# Altium schematic sheet H01R0_Frontend 1.SchDoc
size Letter; CompanyName: Hexabitz; DocumentNumber: 2; SheetNumber: 2; SheetTotal: 3
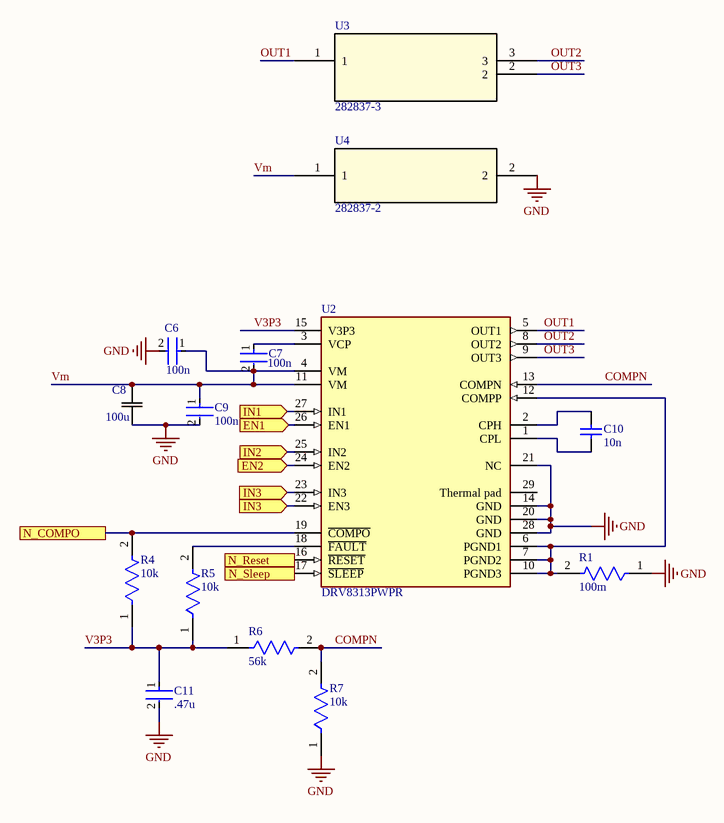
[diagram p0: H01R0_Frontend 1.SchDoc]

## Parts
C6  100n  [FP-1812-L_4_5_0_3-W_3_2_0-IPC_C]
C7  100n  [FP-1812-L_4_5_0_3-W_3_2_0-IPC_C]
C8  100u  [CAP_CL31A_SAM]
C9  100n  [FP-1812-L_4_5_0_3-W_3_2_0-IPC_C]
C10  10n  [CAPC1608X92X38NL15T08]
C11  .47u  [FP-C1206C-EB-MFG]
R1  100m  [FP-PCS2512-IPC_C]
R4  10k  [FP-CRCW2010-e3-IPC_B]
R5  10k  [FP-CRCW2010-e3-IPC_B]
R6  56k  [FP-SMA-A0207-MFG]
R7  10k  [FP-CRCW2010-e3-IPC_B]
U2  DRV8313PWPR  [FP-PWP0028C-IPC_B]
U3  282837-3  [282837-3_TYC]
U4  282837-2  [282837-2_TYC]

## Ports
EN1 (in), EN2 (in), IN1 (in), IN2 (in), IN3 (in), N_COMPO, N_Reset, N_Sleep

## Nets
GND: C6.2 C8.1 C9.2 C11.2 R1.1 R7.1 U2.14(GND) U2.20(GND) U2.21(NC) U2.28(GND) U4.2
COMPN: R6.2 R7.2 U2.13(COMPN)
EN1: U2.26(EN1) ; port EN1
EN2: U2.24(EN2) ; port EN2
IN1: U2.27(IN1) ; port IN1
IN2: U2.25(IN2) ; port IN2
IN3: U2.22(EN3) U2.23(IN3) ; port IN3
N_COMPO: R4.2 U2.19(~{COMPO}) ; port N_COMPO
N_Reset: U2.16(~{RESET}) ; port N_Reset
N_Sleep: U2.17(~{SLEEP}) ; port N_Sleep
OUT1: U2.5(OUT1) U3.1
OUT2: U2.8(OUT2) U3.3
OUT3: U2.9(OUT3) U3.2
V3P3: C11.1 R4.1 R5.1 R6.1 U2.15(V3P3)
Vm: C6.1 C7.2 C8.2 C9.1 U2.4(VM) U2.11(VM) U4.1
NetC7_1: C7.1 U2.3(VCP)
NetC10_1: C10.1 U2.1(CPL)
NetC10_2: C10.2 U2.2(CPH)
NetR1_2: R1.2 U2.6(PGND1) U2.7(PGND2) U2.10(PGND3) U2.12(COMPP)
NetR5_2: R5.2 U2.18(~{FAULT})

Not connected (* = marked no-connect by the designer): U2 29(Thermal_pad)

## Notes on the sheet
- Module:
- Title:
- Description:
- Size:
- Revision:
- Letter
- www.hexabitz.com
- Date:
- Time:
- Sheet
- of

## Library data of the parts
C6 C7 C9 = CMP-1040-01301-2: General Purpose Ceramic Capacitor, 1812, 100nF, 10%, X7R, 15%, 100V; Dissipation Factor: 2.5%; Max Operating Temperature: 125°C; Contact Plating: Tin; Mount: Surface Mount; Case Code (Metric): 4532; Voltage Rating (DC): 100V; Series: -; Case/Package: 1812; Width: 0.126inch; Tolerance: 10%; RoHS Compliant: Yes; Case Code (Imperial): 1812; Voltage: 100V; Dielectric: X7R; Radiation Hardening: No; Construction: Flat; REACH SVHC: No SVHC; Voltage Rating: 100V; Min Operating Temperature: -55°C; Thickness: 0.04inch; Length: 4.5mm; Height: 1.02mm; Packaging: Tape and Reel; Depth: 3.2mm; Package Quantity: 1; Lead Free: Lead Free; Capacitance: 100nF; Number of Pins: 2; Termination: SMD/SMT
C8 = CMP-001-00083-1: No Description Available; Manufacturer_Name: Samsung; Design Item ID: CL31A107MQHNNWE; Source: CL31A107MQHNNWE.SchLib; Manufacturer_Part_Number: CL31A107MQHNNWE; Copyright: Copyright (C) 2025 Ultra Librarian. All rights reserved.
C10 = CMP-2006-01186-1: Part Number: VJ0603Y103KXBAC; Manufacturer: Vitramon
C11 = CMP-03020-031970-1: C1206 0.47 μF X7R 10.00% 25 V; Manufacturer: KEMET; Manufacturer Part Number: C1206C474K3RAC7210; Automotive Grade: Grade 0; Material: Ceramic; Capacitance: 0.47 μF; Value: 0.47 μF; Voltage Rating: 25 V; Tolerance: 0.1; Temperature Coefficient: 15%; Package: C1206C-EB; Device Class L1: Passive Components; Automotive: Yes; Temperature Characteristic: X7R; ComponentLink2Description: Datasheet; Device Class L2: Capacitors; Height: 0.88mm; Category: Cap; Temperature Range High: +150°C; Lead Free: Yes; Temperature Range Low: -55°C; Octopart: https://octopart.com/c1206c474k3rac7210-kemet-13188669; Temperature: -55°C to +150°C; Device Class L3: Ceramic Capacitors; RoHS: TRUE; Mouser Description: Multilayer Ceramic Capacitors MLCC - SMD/SMT 0.47uF 25V 10%; Ipc Land Pattern Name: CAPC320160X78; ComponentLink2URL: https://content.kemet.com/datasheets/KEM_C1007_X8R_ULTRA_150C_SMD.pdf
R1 = CMP-33361-000026-1: 2W 0.100 OHMS 0.5% 2512; RoHS Compliant: Yes
R4 R5 R7 = CMP-1017-00623-2: RES Thick Film, 10kΩ, 1%, 0.75W, 100ppm/°C, 2010; Voltage Rating: 400V; Resistance: 10kR; Power Rating: 750mW; Width: 2.5mm; Case Code (Metric): 5025; Termination: SMD/SMT; Depth: 2.5mm; Contact Plating: Tin; Package Quantity: 4000; Temperature Coefficient: 100ppm/°C; Composition: Thick Film; Case/Package: 2010; Max Operating Temperature: 155°C; Military Standard: Not; Length: 5mm; Weight: 0.000899oz; Height: 0.6mm; Min Operating Temperature: -55°C; Tolerance: 1%; Lead Free: Lead Free; Packaging: Tape and Reel; Case Code (Imperial): 2010; Radiation Hardening: No; Voltage Rating (DC): 400V
R6 = CMP-03211-007753-1: SMA-A 0207 56KΩ 1W 15ppm/ºC 0.10% 350V; Manufacturer: TE Connectivity; Manufacturer Part Number: SMA-A0207BTNT56K; Tolerance: 0.001; Automotive Grade: Grade 0; Series: SMA-A; ComponentLink2URL: https://www.te.com/commerce/DocumentDelivery/DDEController?Action=showdoc&DocId=Data+Sheet%7F6-1773446-2%7F1%7Fpdf%7FEnglish%7FENG_DS_6-1773446-2_1.pdf%7F3-2176316-27088; Temperature Range Low: -55°C; Temperature Coefficient: 15ppm/ºC; Device Class L3: Chip SMD Resistors; RoHS: TRUE; Temperature: -55°C to +155°C; Footprint Url: https://www.te.com/commerce/DocumentDelivery/DDEController?Action=showdoc&DocId=Customer+Drawing%7F2176316%7FBA%7Fpdf%7FEnglish%7FENG_CD_2176316_BA.pdf%7F3-2176316-27088; Power Rating: 1W; Octopart: https://octopart.com/sma-a0207btnt56k-te+connectivity-89230475; Temperature Range High: +155°C; Value: 56KΩ; Device Class L1: Passive Components; Automotive: Yes; Resistance: 56KΩ; Composition: Metal Film; Device Class L2: Resistors; Category: Res; Lead Free: Yes; Height: 2.4mm; ComponentLink2Description: Datasheet; Voltage Rating: 350V; Package: SMA-A0207
U2 = CMP-04915-000025-1: IC MOTOR DRIVER 8V-60V 28HTSSOP; Min Supply Voltage: 8V; Max Supply Voltage: 60V; Interface: Parallel; Output Current: 1.75A; Number of Outputs: 1; Logic Function: AND GATE; Package Quantity: 2000; Number of Pins: 28; Case/Package: HTSSOP; Min Operating Temperature: -40°C; Mount: Surface Mount; Series: -; Packaging: Tape and Reel; Max Operating Temperature: 125°C; Lead Free: Lead Free
U3 = CMP-007-000000-1: TERMI-BLOK PCB MOUNT 3P; Manufacturer_Name: TE Connectivity; Source: 282837-3.SchLib; Type: Type; Copyright: Copyright (C) 2025 Ultra Librarian. All rights reserved.; Design Item ID: 282837-3; RefDes: RefDes; Manufacturer_Part_Number: 282837-3
U4 = CMP-010-000000-1: TERMI-BLOK PCB MOUNT 2P; Manufacturer_Name: TE Connectivity; Source: 282837-2.SchLib; RefDes: RefDes; Type: Type; Copyright: Copyright (C) 2025 Ultra Librarian. All rights reserved.; Design Item ID: 282837-2; Manufacturer_Part_Number: 282837-2